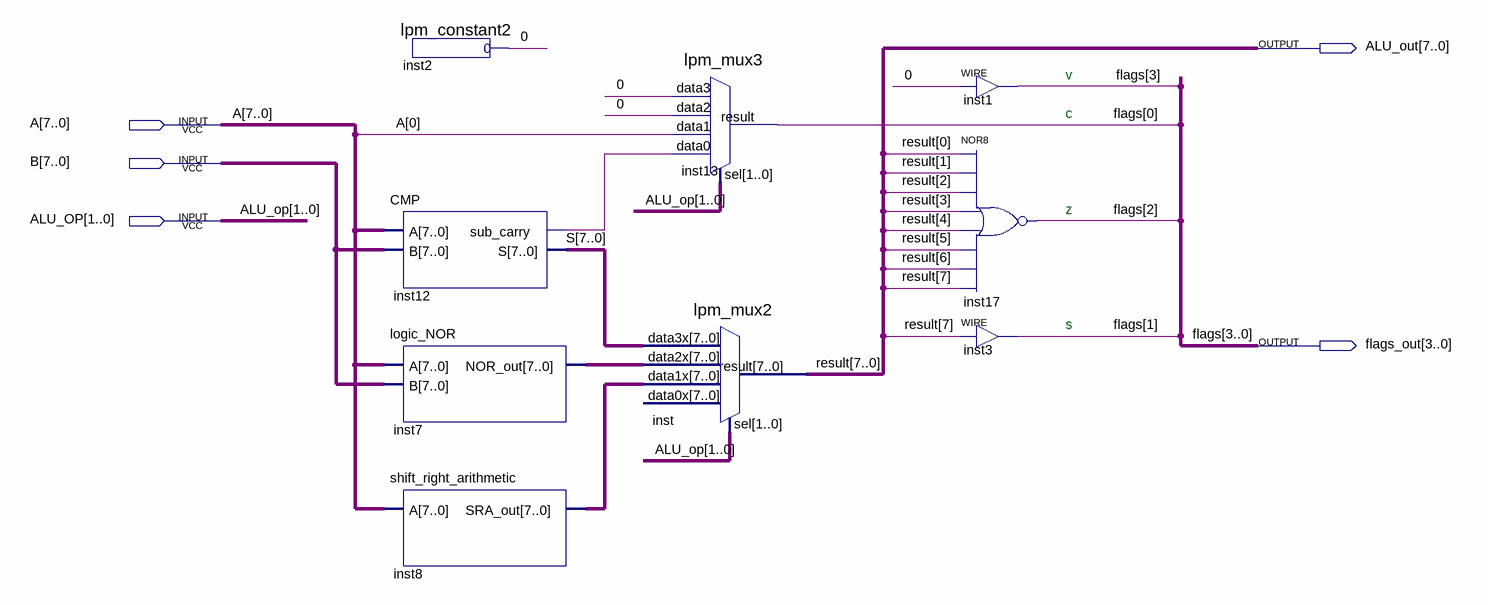
[diagram p0: schematic sheet]
// Quartus schematic arithmetic_logic_unit.bdf as structural Verilog: 9 symbols, 5 pins
module arithmetic_logic_unit (
  input  [7:0] A,
  input  [7:0] B,
  input  [1:0] ALU_OP,
  output [7:0] ALU_out,
  output [3:0] flags_out
);

  wire \0 , inst12_sub_carry;
  wire [7:0] inst7_nor_out, inst8_sra_out, S;

  lpm_constant2 inst2 (.result(\0 ));
  CMP inst12 (.A(A), .B(B), .sub_carry(inst12_sub_carry), .S(S));
  logic_NOR inst7 (.A(A), .B(B), .NOR_out(inst7_nor_out));
  shift_right_arithmetic inst8 (.A(A), .SRA_out(inst8_sra_out));
  lpm_mux3 inst13 (
    .data3(\0 ), .data2(\0 ), .data1(A[0]), .data0(inst12_sub_carry), .sel(ALU_OP), .result(flags_out[0]));
  lpm_mux2 inst (
    .data3x(S), .data2x(inst7_nor_out), .data1x(inst8_sra_out), .sel(ALU_OP), .result(ALU_out));  // open: data0x
  assign flags_out[3] = \0 ;  // WIRE inst1
  nor inst17 (flags_out[2], ALU_out[0], ALU_out[1], ALU_out[2], ALU_out[3], ALU_out[4], ALU_out[5], ALU_out[6], ALU_out[7]);
  assign flags_out[1] = ALU_out[7];  // WIRE inst3

  // Other names for the same wires on the sheet: result[7:0] = ALU_out; flags[3:0] = flags_out

  // Notes on the sheet:
  //   v
  //   c
  //   z
  //   s
endmodule
